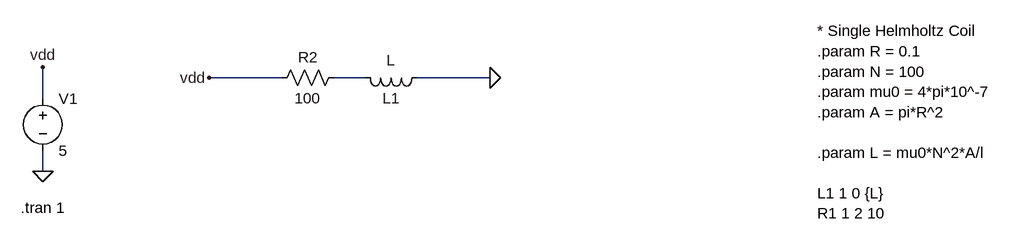
[diagram p0: schematic project_2.asc]
project_2.asc, the LTspice schematic file:
Version 4
SHEET 1 1136 680
WIRE 0 96 -112 96
WIRE 128 96 80 96
WIRE 320 96 208 96
WIRE -368 128 -368 80
WIRE -368 240 -368 208
FLAG -368 240 0
FLAG -368 80 vdd
FLAG 320 96 0
FLAG -112 96 vdd
SYMBOL ind 224 80 R90
WINDOW 0 5 56 VBottom 2
WINDOW 3 32 56 VTop 2
SYMATTR InstName L
SYMATTR Value L1
SYMBOL res 96 80 R90
WINDOW 0 0 56 VBottom 2
WINDOW 3 32 56 VTop 2
SYMATTR InstName R2
SYMATTR Value 100
SYMBOL voltage -368 112 R0
WINDOW 123 0 0 Left 0
WINDOW 39 0 0 Left 0
SYMATTR InstName V1
SYMATTR Value 5
TEXT 824 24 Left 2 !* Single Helmholtz Coil\n.param R = 0.1\n.param N = 100\n.param mu0 = 4*pi*10^-7\n.param A = pi*R^2\n \n.param L = mu0*N^2*A/l\n \nL1 1 0 {L}\nR1 1 2 10
TEXT -402 296 Left 2 !.tran 1

The netlist it stands for:
* project_2.asc
L 0 N001 L1
R2 N001 vdd 100
V1 vdd 0 5
* Single Helmholtz Coil
.param R = 0.1
.param N = 100
.param mu0 = 4*pi*10^-7
.param A = pi*R^2
.param L = mu0*N^2*A/l
L1 1 0 {L}
R1 1 2 10
.tran 1
.backanno
.end